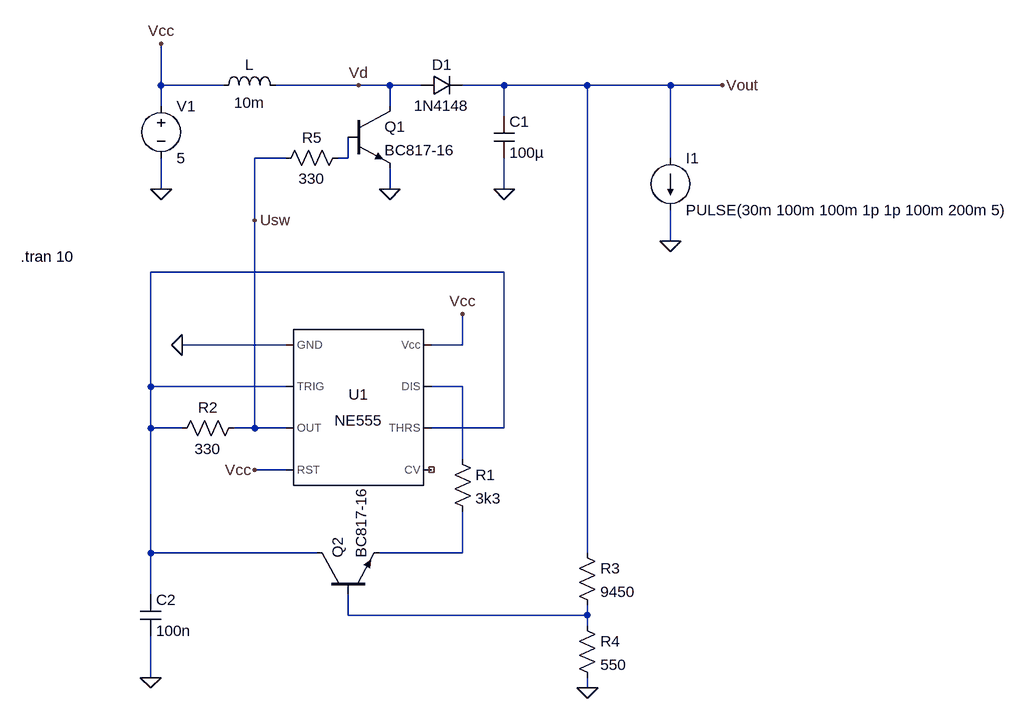
[diagram p0: schematic 555_boost.asc]
555_boost.asc, the LTspice schematic file:
Version 4.1
SHEET 1 1404 820
WIRE 64 -128 64 -192
WIRE 160 -128 64 -128
WIRE 368 -128 240 -128
WIRE 416 -128 368 -128
WIRE 464 -128 416 -128
WIRE 592 -128 528 -128
WIRE 720 -128 592 -128
WIRE 848 -128 720 -128
WIRE 928 -128 848 -128
WIRE 64 -96 64 -128
WIRE 416 -96 416 -128
WIRE 592 -80 592 -128
WIRE 256 -16 208 -16
WIRE 352 -16 352 -48
WIRE 352 -16 336 -16
WIRE 848 -16 848 -128
WIRE 64 32 64 -16
WIRE 416 32 416 0
WIRE 592 32 592 -16
WIRE 208 80 208 -16
WIRE 848 112 848 64
WIRE 592 160 48 160
WIRE 256 272 96 272
WIRE 528 272 528 224
WIRE 528 272 480 272
WIRE 48 336 48 160
WIRE 256 336 48 336
WIRE 528 336 480 336
WIRE 48 400 48 336
WIRE 96 400 48 400
WIRE 208 400 208 80
WIRE 208 400 176 400
WIRE 256 400 208 400
WIRE 592 400 592 160
WIRE 592 400 480 400
WIRE 528 448 528 336
WIRE 256 464 208 464
WIRE 48 592 48 400
WIRE 304 592 48 592
WIRE 528 592 528 528
WIRE 528 592 400 592
WIRE 720 592 720 -128
WIRE 48 656 48 592
WIRE 352 688 352 656
WIRE 720 688 720 672
WIRE 720 688 352 688
WIRE 720 704 720 688
WIRE 48 784 48 720
WIRE 720 800 720 784
FLAG 592 32 0
FLAG 416 32 0
FLAG 96 272 0
FLAG 64 -192 Vcc
FLAG 64 32 0
FLAG 48 784 0
FLAG 208 464 Vcc
FLAG 528 224 Vcc
FLAG 720 800 0
FLAG 928 -128 Vout
FLAG 848 112 0
FLAG 208 80 Usw
FLAG 368 -128 Vd
SYMBOL Misc\\NE555 368 368 R0
SYMATTR InstName U1
SYMBOL ind 144 -112 R270
WINDOW 0 32 56 VTop 2
WINDOW 3 5 56 VBottom 2
SYMATTR InstName L
SYMATTR Value 10m
SYMBOL diode 464 -112 R270
WINDOW 0 32 32 VTop 2
WINDOW 3 0 32 VBottom 2
SYMATTR InstName D1
SYMATTR Value 1N4148
SYMBOL cap 576 -80 R0
SYMATTR InstName C1
SYMATTR Value 100µ
SYMBOL voltage 64 -112 R0
WINDOW 123 0 0 Left 0
WINDOW 39 0 0 Left 0
SYMATTR InstName V1
SYMATTR Value 5
SYMBOL res 192 384 R90
WINDOW 0 0 56 VBottom 2
WINDOW 3 32 56 VTop 2
SYMATTR InstName R2
SYMATTR Value 330
SYMBOL cap 32 656 R0
SYMATTR InstName C2
SYMATTR Value 100n
SYMBOL res 704 576 R0
SYMATTR InstName R3
SYMATTR Value 9450
SYMBOL res 704 688 R0
SYMATTR InstName R4
SYMATTR Value 550
SYMBOL npn 304 656 R270
SYMATTR InstName Q2
SYMATTR Value BC817-16
SYMBOL current 848 -16 R0
WINDOW 123 0 0 Left 0
WINDOW 39 0 0 Left 0
SYMATTR InstName I1
SYMATTR Value PULSE(30m 100m 100m 1p 1p 100m 200m 5)
SYMBOL res 512 432 R0
SYMATTR InstName R1
SYMATTR Value 3k3
SYMBOL res 352 -32 R90
WINDOW 0 0 56 VBottom 2
WINDOW 3 32 56 VTop 2
SYMATTR InstName R5
SYMATTR Value 330
SYMBOL npn 352 -96 R0
SYMATTR InstName Q1
SYMATTR Value BC817-16
TEXT -152 136 Left 2 !.tran 10

The netlist it stands for:
* 555_boost.asc
X§U1 0 N002 Usw Vcc NC_01 N002 N003 Vcc NE555  ; pins GND TRIG OUT RST CV THRS DIS Vcc
L Vcc Vd 10m
D1 Vd Vout 1N4148
C1 Vout 0 100µ
V1 Vcc 0 5
R2 Usw N002 330
C2 N002 0 100n
R3 Vout N005 9450
R4 N005 0 550
Q2 N002 N005 N004 0 BC817-16
I1 Vout 0 PULSE(30m 100m 100m 1p 1p 100m 200m 5)
R1 N003 N004 3k3
R5 N001 Usw 330
Q1 Vd N001 0 0 BC817-16
.model D D
.lib standard.dio
.model NPN NPN
.model PNP PNP
.lib standard.bjt
.tran 10
.lib NE555.sub
.backanno
.end